# Altium schematic sheet esq.SchDoc
size A4; SheetNumber: 1; SheetTotal: 1; Titulo: CIRCUITO CORTINA-SIMULADO; Alumno: GRUPO 16; profesor: -; curso: 6TO B; TPN: -; NLista: -; Asignatura: PROYECTO; Año: 2020; Rule: PcbType=ProtelPcb
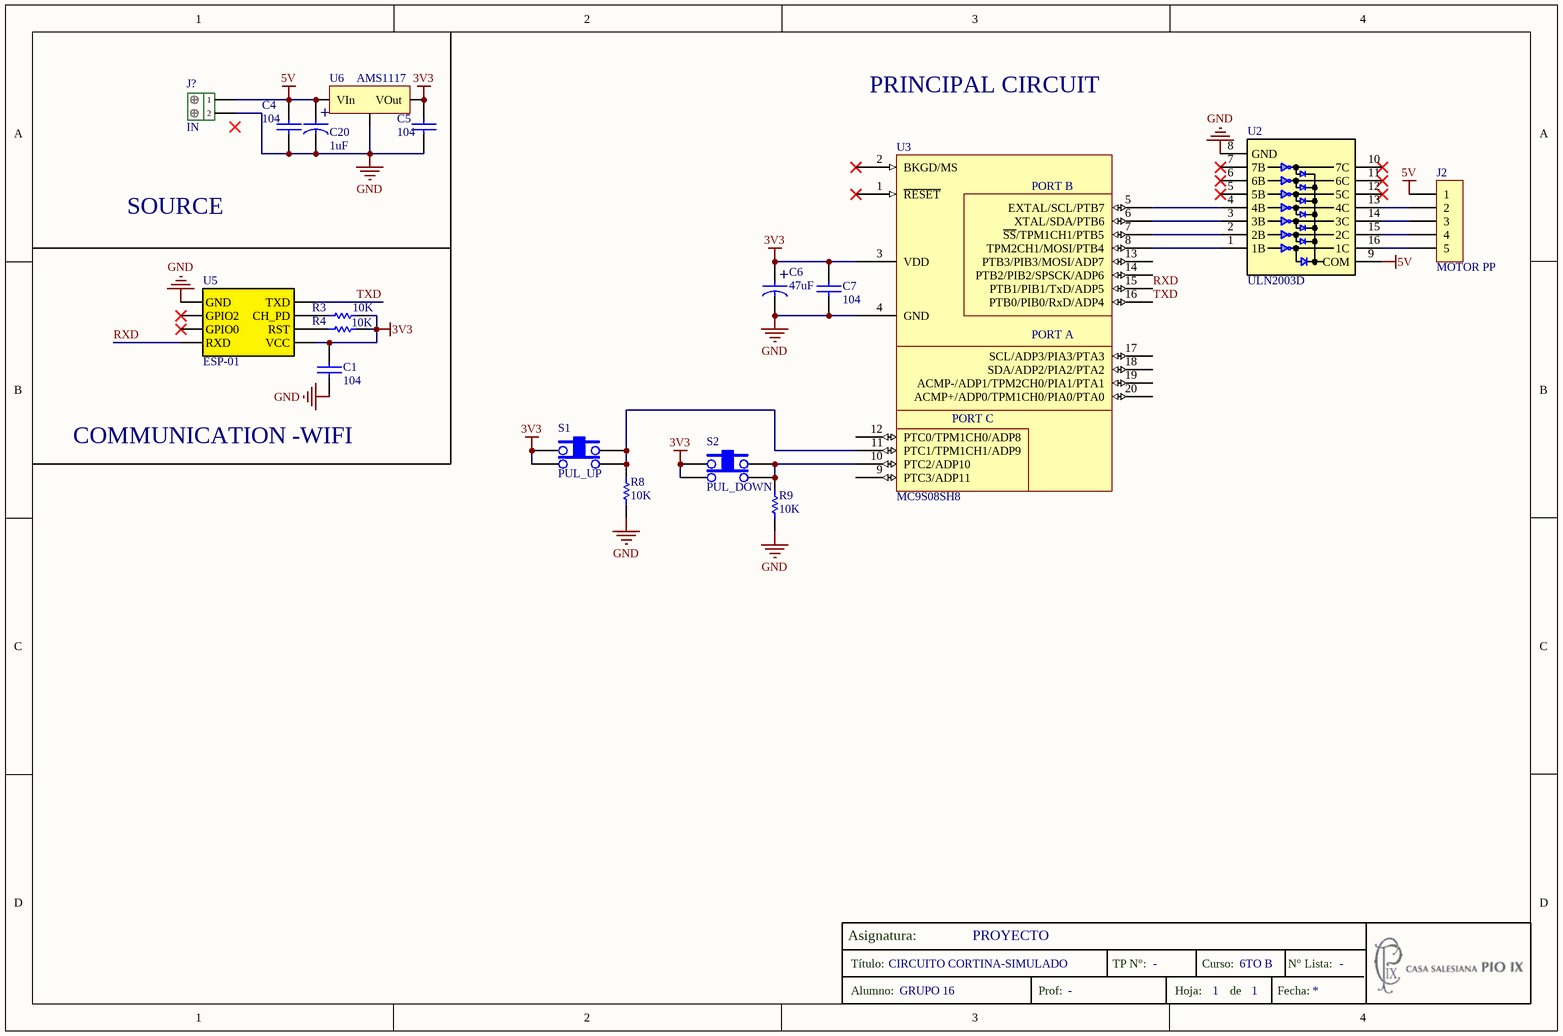
[diagram p0: esq.SchDoc]

## Parts
C1  104  [0805]
C4  104  [0805]
C5  104  [0805]
C6  47uF  [CAP100RP]
C7  104  [0805]
C20  1uF  [CAP100RP]
J2  MOTOR PP  [SIP5]
J?  IN  [BORNERA2]
R3  10K  [0805]
R4  10K  [0805]
R8  10K  [0805]
R9  10K  [0805]
S1  PUL_UP  [pul_grande]
S2  PUL_DOWN  [pul_grande]
U2  ULN2003D  [SOIC16]
U3  MC9S08SH8  [SH8]
U5  ESP-01  [ESP-01]
U6  AMS1117  [AMS1117]

## Nets
3V3: C1.2 C5.1 C6.1 C7.2 R3.1 R4.1 S1.1 S1.2 S2.1 S2.2 U3.3(VDD) U5.8(VCC) U6.3(VOut)
5V: C4.1 C20.1 J2.1 J?.1 U2.9(COM) U6.1(VIn)
GND: C1.1 C4.2 C5.2 C6.2 C7.1 C20.2 J?.2 R8.2 R9.2 U2.8(GND) U3.4(GND) U5.1(GND) U6.2(GND)
RXD: U3.15(PTB1/PIB1/TxD/ADP5) U5.4(RXD)
TXD: U3.16(PTB0/PIB0/RxD/ADP4) U5.5(TXD)
NetJ2_2: J2.2 U2.13(4C)
NetJ2_3: J2.3 U2.14(3C)
NetJ2_4: J2.4 U2.15(2C)
NetJ2_5: J2.5 U2.16(1C)
NetR3_2: R3.2 U5.6(CH_PD)
NetR4_2: R4.2 U5.7(RST)
NetR8_1: R8.1 S1.3 S1.4 U3.11(PTC1/TPM1CH1/ADP9)
NetR9_1: R9.1 S2.3 S2.4 U3.10(PTC2/ADP10)
NetU2_1: U2.1(1B) U3.8(TPM2CH1/MOSI/PTB4)
NetU2_2: U2.2(2B) U3.7(~{SS}/TPM1CH1/PTB5)
NetU2_3: U2.3(3B) U3.6(XTAL/SDA/PTB6)
NetU2_4: U2.4(4B) U3.5(EXTAL/SCL/PTB7)

Not connected (* = marked no-connect by the designer): U2 5(5B)* 6(6B)* 7(7B)* 10(7C)* 11(6C)* 12(5C)*; U3 1(~{RESET})* 2(BKGD/MS)* 9(PTC3/ADP11) 12(PTC0/TPM1CH0/ADP8) 13(PTB3/PIB3/MOSI/ADP7) 14(PTB2/PIB2/SPSCK/ADP6) 17(SCL/ADP3/PIA3/PTA3) 18(SDA/ADP2/PIA2/PTA2) 19(ACMP-/ADP1/TPM2CH0/PIA1/PTA1) 20(ACMP+/ADP0/TPM1CH0/PIA0/PTA0); U5 2(GPIO2)* 3(GPIO0)*

## Notes on the sheet
- PRINCIPAL CIRCUIT
- SOURCE
- COMMUNICATION -WIFI
- Asignatura:
- Título:
- TP N°:
- Curso:
- N° Lista:
- Alumno:
- Prof:
- Hoja:
- de
- Fecha:
- (in symbol CAPPOL) +
- (in symbol MC9S08SH8) PORT B; PORT A; PORT C

## Library data of the parts
C1 C4 C5 C7 = CAP: Autor: Guido Spataro; Data: Libebal; Fecha: 07/04/19
C6 C20 = CAPPOL: Cap polarizado
J2 = CON5
J? = Bornera_2: Bornera de 2 pines; Autor: Guido Spataro; Datasheet: Libebal; Fecha: 07/04/19
R3 R4 R8 R9 = RES: Resistencia; Autor: Guido Spataro; Data: Libebal; Fecha: 07/04/19
S1 S2 = TACT SWITCH
U2 = ULN2003D: Controlador de corriente; AUTOR: MARTINEZ Agustin; FECHA: 5/4; DATASHEET: https://pdf1.alldatasheet.com/datasheet-pdf/view/25572/STMICROELECTRONICS/ULN2003D.html
U3 = MC9S08SH8: Micro controlador; Autor: Guido Spataro; data: https://www.nxp.com/docs/en/data-sheet/MC9S08SH8.pdf; Fecha: 07/04/19